# EAGLE design tick-wifi-mini-mk-1.2 (EAGLE 7.5.0)
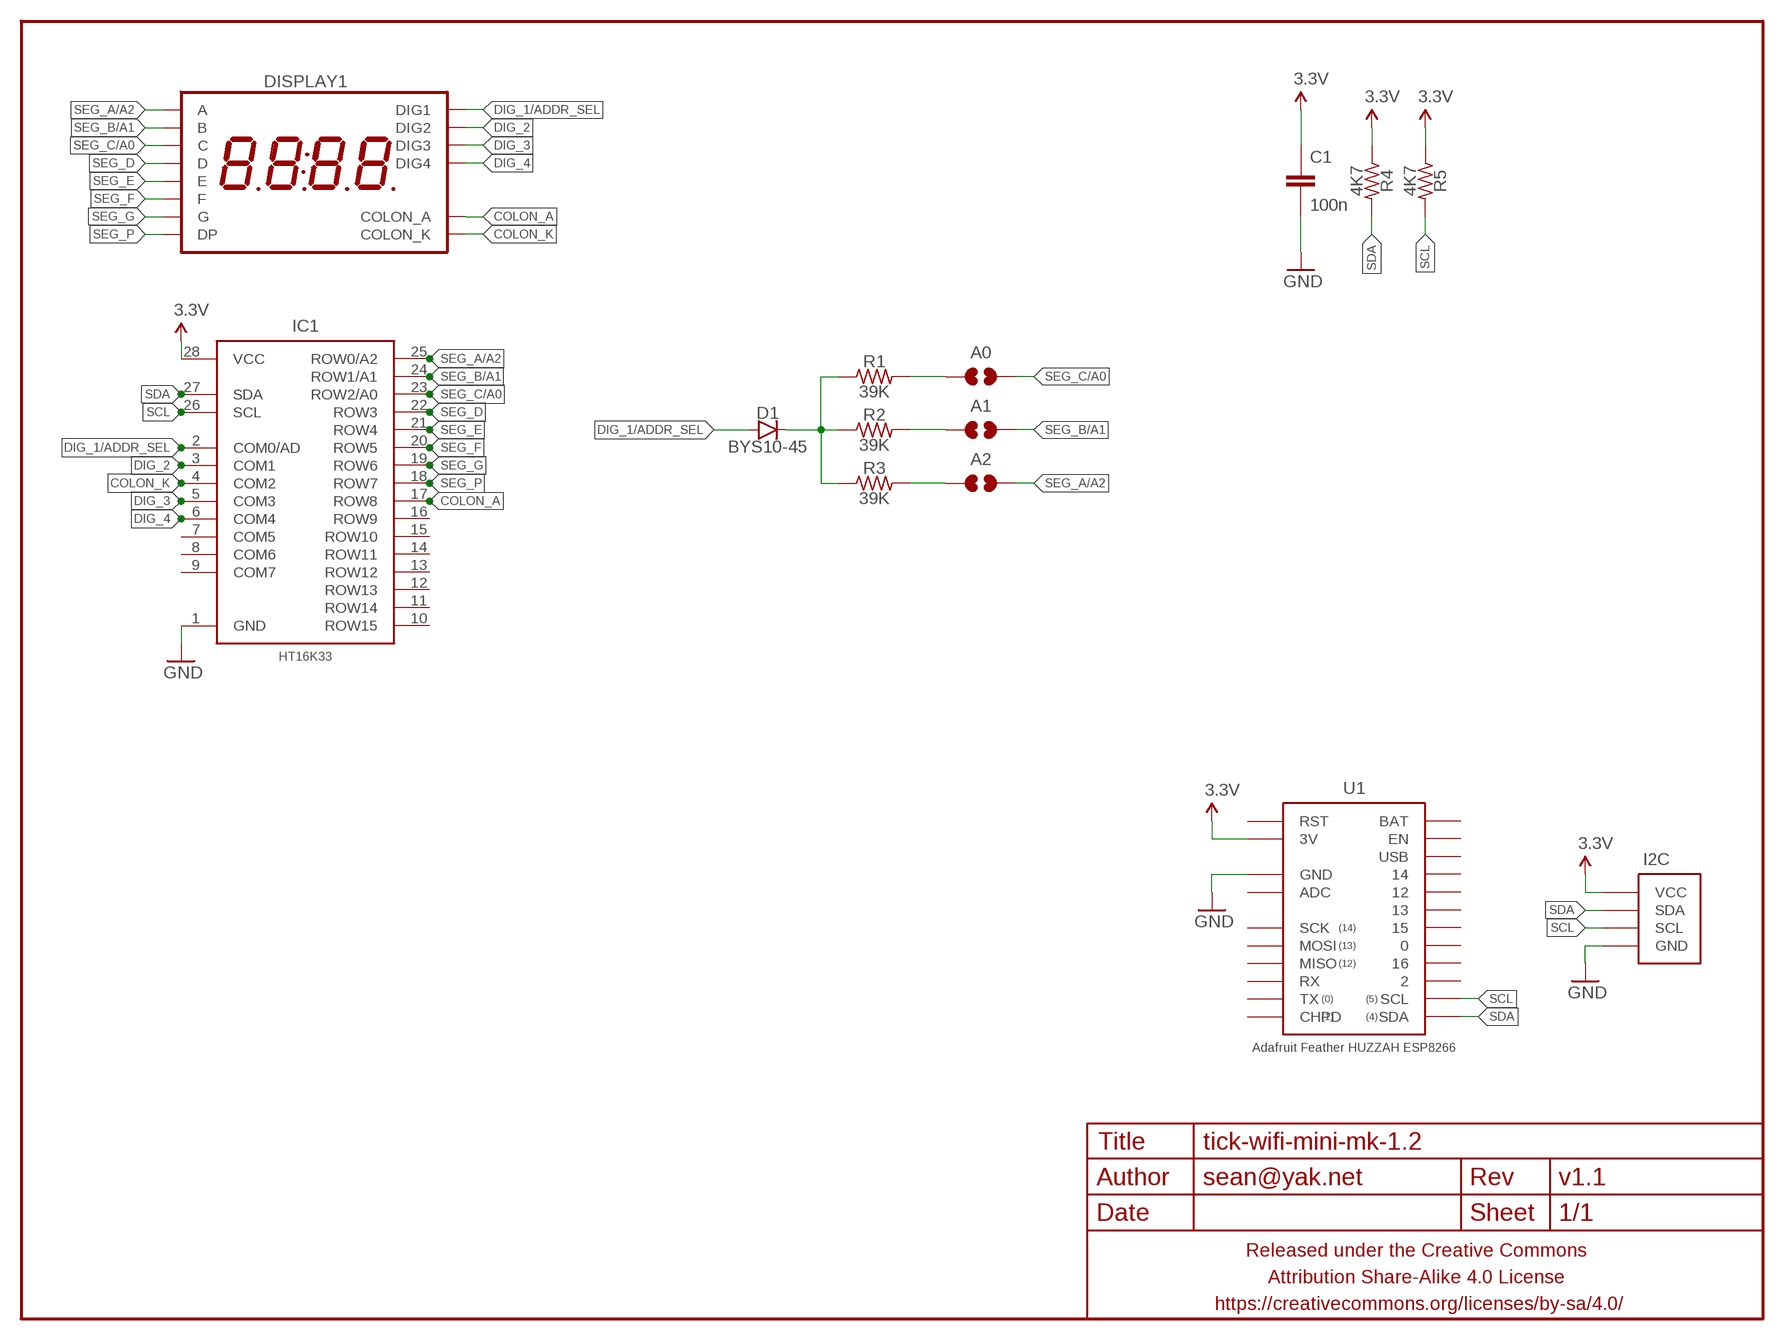
[diagram p0: schematic, sheet 1]

## Parts
A0  JUMPER-PAD-2-NOYES_SILK  [PAD-JUMPER-2-NO_YES_SILK]
A1  JUMPER-PAD-2-NOYES_SILK  [PAD-JUMPER-2-NO_YES_SILK]
A2  JUMPER-PAD-2-NOYES_SILK  [PAD-JUMPER-2-NO_YES_SILK]
C1  100n  CAPACITOR-CERAMICC0805  [C0805]
D1  BYS10-45  DIODESOD123  [SOD123]
DISPLAY1  7SEG_4DIGIT_COLON14.2MM-CC  [7SEG_4DIG_0.56IN_14MM_ADAFRUIT]
FRAME1  FRAME-LETTERNO_PACKAGE  [DUMMY]
I2C  M04-I2CJST-4-PH-VERT-CENTERED-I2C  [JST-4-PH-VERT-PTH-CENTERED-I2C]
IC1  HT16K33  HT16K33-28SOIC28W  [SOIC28W]
R1  39K  RESISTORR0805  [R0805]
R2  39K  RESISTORR0805  [R0805]
R3  39K  RESISTORR0805  [R0805]
R4  4K7  RESISTORR0805  [R0805]
R5  4K7  RESISTORR0805  [R0805]
U1  Adafruit Feather HUZZAH ESP8266  ADAFRUIT_FEATHER_HUZZAH_ESP8266NOSILK  [ADAFRUIT_FEATHER_HUZZAH_NOSILK]

## Nets
3.3V: C1.1 I2C.2(VCC) IC1.28(VCC) R4.1 R5.1 U1.3V
COLON_A: DISPLAY1.P$8(COLON_A) IC1.17(ROW8)
COLON_K: DISPLAY1.P$7(COLON_K) IC1.4(COM2)
DIG_1/ADDR_SEL: D1.A DISPLAY1.P$14(DIG1) IC1.2(COM0/AD)
DIG_2: DISPLAY1.P$11(DIG2) IC1.3(COM1)
DIG_3: DISPLAY1.P$10(DIG3) IC1.5(COM3)
DIG_4: DISPLAY1.P$6(DIG4) IC1.6(COM4)
GND: C1.2 I2C.1(GND) IC1.1(GND) U1.GND@0(GND)
N$1: D1.C R1.1 R2.1 R3.1
N$2: A0.1 R1.2
N$3: A1.1 R2.2
N$4: A2.1 R3.2
SCL: I2C.4(SCL) IC1.26(SCL) R5.2 U1.SCL
SDA: I2C.3(SDA) IC1.27(SDA) R4.2 U1.SDA
SEG_A/A2: A2.2 DISPLAY1.P$13(A) IC1.25(ROW0/A2)
SEG_B/A1: A1.2 DISPLAY1.P$9(B) IC1.24(ROW1/A1)
SEG_C/A0: A0.2 DISPLAY1.P$4(C) IC1.23(ROW2/A0)
SEG_D: DISPLAY1.P$2(D) IC1.22(ROW3)
SEG_E: DISPLAY1.P$1(E) IC1.21(ROW4)
SEG_F: DISPLAY1.P$12(F) IC1.20(ROW5)
SEG_G: DISPLAY1.P$5(G) IC1.19(ROW6)
SEG_P: DISPLAY1.P$3(DP) IC1.18(ROW7)
Unconnected: IC1.7(COM5) IC1.8(COM6) IC1.9(COM7) IC1.10(ROW15) IC1.11(ROW14) IC1.12(ROW13) IC1.13(ROW12) IC1.14(ROW11) IC1.15(ROW10) IC1.16(ROW9) U1.0 U1.2 U1.12 U1.13 U1.14 U1.15 U1.16 U1.ADC U1.BAT U1.CHPD U1.EN U1.MISO U1.MOSI U1.RST U1.RX U1.SCK U1.TX U1.USB

## Library data of the parts
A0 A1 A2 = a_parts:JUMPER-PAD-2-NO
C1 = a_parts:CAPACITOR-CERAMIC: CAPACITOR, European symbol
D1 = a_parts:DIODE: Diode These are standard reverse protection diodes and small signal diodes. SMA package can handle up to about 1A. SOD-323 can handle about 200mA. What the SOD-323 package when ordering, there are some mfgs out there that are 5-pin packages.
DISPLAY1 = a_parts:7SEG_4DIGIT_COLON
FRAME1 = A_butts:FRAME-LETTER: Schematic Frame Standard 8.5x11 US Letter frame; DESIGNER: sean@yak.net; VERSION: v1.1
I2C = a_parts:M04-I2C
IC1 = a_parts:HT16K33-28
R1-R5 = a_parts:RESISTOR: RESISTOR, American symbol
U1 = a_parts:ADAFRUIT_FEATHER_HUZZAH_ESP8266

## Board
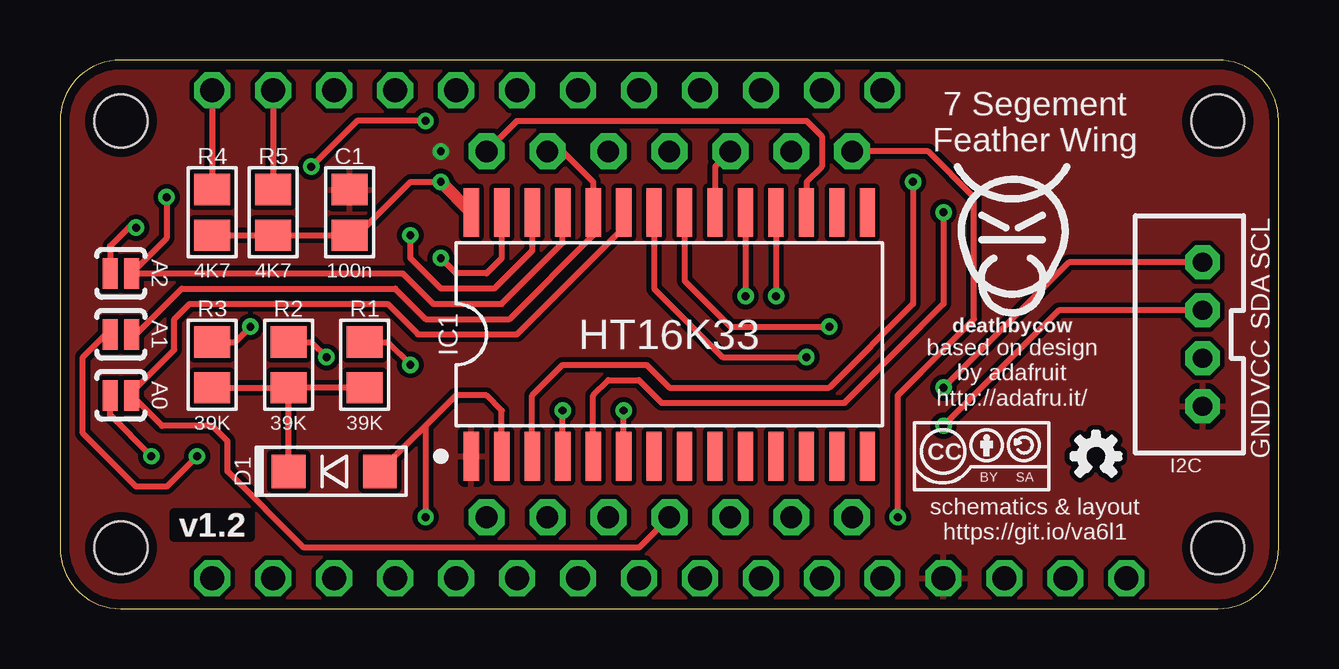
[diagram p1: board, top side]
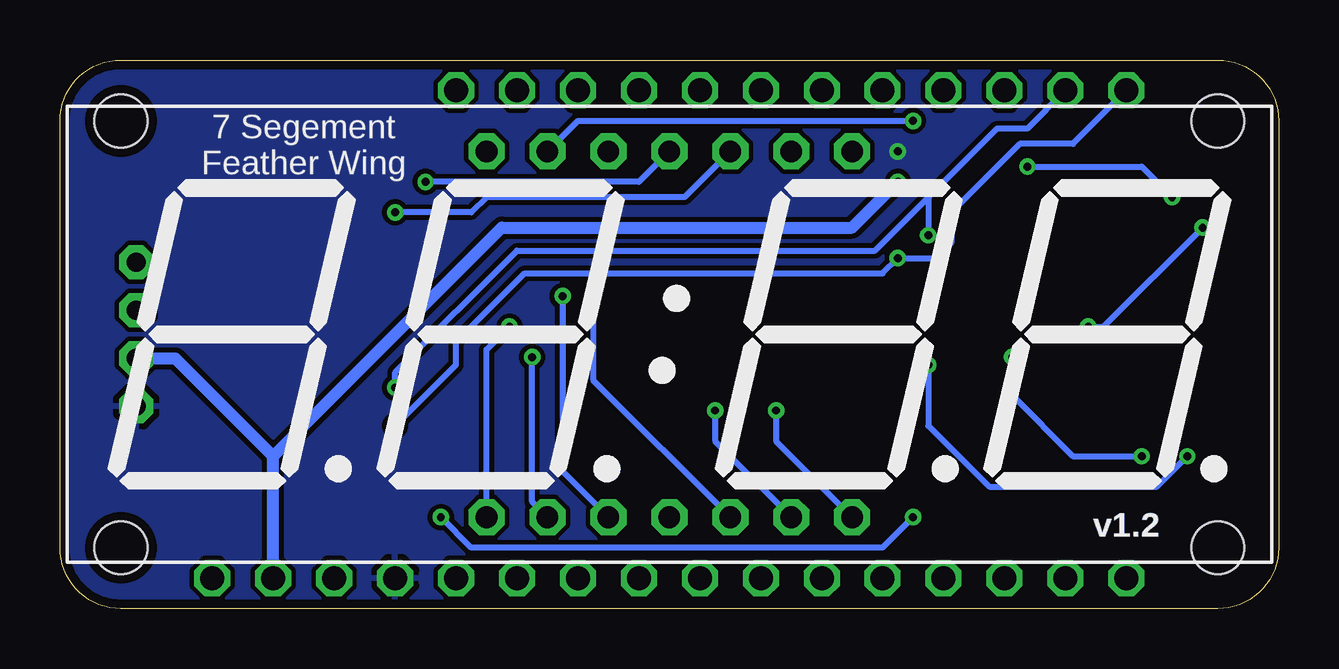
[diagram p2: board, bottom side, seen from below]

Size 50.8 x 22.86 mm. Coordinates in mm from the lower left corner, seen from the top.
Outline: 2.54,0 48.26,0 arc90 50.8,2.54 50.8,20.32 arc90 48.26,22.86 2.54,22.86 arc90 0,20.32 0,2.54 arc90 2.54,0
Copper layers (1*16): Top 0.0356mm / dielectric 1.5011mm / Bottom 0.0356mm
Design rules "LaenPCBOrder_2": minimum track width 6mil, minimum drill 13mil, track to track 6mil, track to pad 6mil, pad to pad 6mil, via to via 6mil, smd to smd 6mil, copper to edge 15mil, drill to drill 6mil, minimum pad ring 7mil, minimum via ring 7mil, stop-mask expansion 3mil, vias tented up to drill 20mil, thermal gap 10mil
Holes 2.2 mm at 2.54,20.32 2.54,2.54 48.26,20.32 48.26,2.54

### Footprints (pad centres in the part's own frame; a part is rotated, then mirrored left to right if it is on the bottom)
PAD-JUMPER-2-NO_YES_SILK = smd 0.635 x 1.27: 1 -0.45,0; 2 0.45,0
C0805 = smd 1.3 x 1.5: 1 -0.95,0; 2 0.95,0
SOD123 = smd 1.4 x 1.4: A 1.9,0; C -1.9,0
7SEG_4DIG_0.56IN_14MM_ADAFRUIT = drill 0.9 pad 1.5 octagon: P$1 -7.62,-7.62; P$2 -5.08,-7.62; P$3 -2.54,-7.62; P$4 0,-7.62; P$5 2.54,-7.62; P$6 5.08,-7.62; P$7 7.62,-7.62; P$8 7.62,7.62; P$9 5.08,7.62; P$10 2.54,7.62; P$11 0,7.62; P$12 -2.54,7.62; P$13 -5.08,7.62; P$14 -7.62,7.62
JST-4-PH-VERT-PTH-CENTERED-I2C = drill 0.8 pad 1.422 octagon: 1 -3,0; 2 -1,0; 3 1,0; 4 3,0
SOIC28W = smd 0.635 x 2.032: 1 -8.255,-5.08; 2 -6.985,-5.08; 3 -5.715,-5.08; 4 -4.445,-5.08; 5 -3.175,-5.08; 6 -1.905,-5.08; 7 -0.635,-5.08; 8 0.635,-5.08; 9 1.905,-5.08; 10 3.175,-5.08; 11 4.445,-5.08; 12 5.715,-5.08; 13 6.985,-5.08; 14 8.255,-5.08; 15 8.255,5.08; 16 6.985,5.08; 17 5.715,5.08; 18 4.445,5.08; 19 3.175,5.08; 20 1.905,5.08; 21 0.635,5.08; 22 -0.635,5.08; 23 -1.905,5.08; 24 -3.175,5.08; 25 -4.445,5.08; 26 -5.715,5.08; 27 -6.985,5.08; 28 -8.255,5.08
R0805 = smd 1.3 x 1.5: 1 -0.95,0; 2 0.95,0
ADAFRUIT_FEATHER_HUZZAH_NOSILK = drill 1 pad 1.5 octagon: 0 8.89,10.16; 2 13.97,10.16; 3V -16.51,-10.16; 12 1.27,10.16; 13 3.81,10.16; 14 -1.27,10.16; 15 6.35,10.16; 16 11.43,10.16; ADC -8.89,-10.16; BAT -8.89,10.16; CHPD 19.05,-10.16; EN -6.35,10.16; GND@0 -11.43,-10.16; MISO 11.43,-10.16; MOSI 8.89,-10.16; NC@3 -13.97,-10.16; NC@6 -6.35,-10.16; NC@7 -3.81,-10.16; NC@8 -1.27,-10.16; NC@9 1.27,-10.16; NC@10 3.81,-10.16; RST -19.05,-10.16; RX 13.97,-10.16; SCK 6.35,-10.16; SCL 16.51,10.16; SDA 19.05,10.16; TX 16.51,-10.16; USB -3.81,10.16

### Placement (x,y rotation side)
A0  2.54,8.89 0 top
A1  2.54,11.43 0 top
A2  2.54,13.97 0 top
C1  12.06,16.51 90 top
D1  11.43,5.71 0 top
DISPLAY1  25.4,11.43 0 bottom
FRAME1  0,0 0 top
I2C  47.62,11.43 90 top
IC1  25.4,11.43 0 top
R1  12.7,10.16 90 top
R2  9.53,10.16 90 top
R3  6.35,10.16 90 top
R4  6.35,16.51 90 top
R5  8.89,16.51 90 top
U1  25.4,11.43 0 bottom
U$1  [OSHWLOGO_TINY]  43.18,6.35 0 top
U$2  [COW_SMALL]  39.69,15.88 0 top
U$4  [CC-BY-SA-4.0-NO-URL]  38.42,6.35 0 top

### Tracks (layer width: path | path; a pad name or v marks a point on that pad's centre or on a via)
3.3V  (via drill 0.33)
  Top 0.254: R4.1 R5.1 C1.1 12.38,15.56 14.61,17.78 v15.88,17.78
  Top 0.508: IC1.28 v15.88,17.78
  Bottom 0.508: U1.3V 41.91,6.35 | 41.91,6.35 32.38,15.88 17.78,15.88 v15.88,17.78 | I2C.2 45.99,10.43 41.91,6.35
COLON_A
  Top 0.254: DISPLAY1.P$8 19.05,20.32 31.11,20.32 31.75,19.68 31.75,18.41 31.11,17.78 IC1.17
COLON_K  (via drill 0.33)
  Top 0.254: IC1.4 v20.95,8.26
  Bottom 0.254: v20.95,8.26 20.95,6.99 DISPLAY1.P$7
DIG_1/ADDR_SEL  (via drill 0.33)
  Top 0.254: IC1.2 18.41,8.26 17.78,8.89 16.51,8.89 | 16.51,8.89 16.5,8.89 D1.A | 16.51,8.89 15.24,7.62 v15.24,3.81 | v34.92,3.81 34.92,8.89 38.1,12.06 38.1,17.14 36.2,19.05 DISPLAY1.P$14
  Bottom 0.254: v15.24,3.81 16.51,2.54 33.66,2.54 v34.92,3.81
DIG_2  (via drill 0.33)
  Top 0.254: IC1.3 19.68,8.89 20.95,10.16 24.45,10.16 25.4,9.21 32.07,9.21 35.56,12.7 v35.56,17.78
  Bottom 0.254: DISPLAY1.P$11 26.67,17.78 v35.56,17.78
DIG_3  (via drill 0.33)
  Top 0.254: IC1.5 22.23,8.89 22.86,9.53 24.13,9.53 25.08,8.57 32.7,8.57 36.83,12.7 v36.83,16.51
  Bottom 0.254: DISPLAY1.P$10 24.77,17.14 33.02,17.14 33.66,16.51 v36.83,16.51
DIG_4  (via drill 0.33)
  Top 0.254: IC1.6 v23.5,8.26
  Bottom 0.254: v23.5,8.26 23.5,6.99 DISPLAY1.P$6
GND  (via drill 0.33)
  other vias: 15.88,19.05
  pour Top (isolate 0.2): 2.54,22.86 48.26,22.86 arc-90 50.8,20.32 50.8,2.54 arc-90 48.26,0 2.54,0 arc-90 0,2.54 0,20.32 arc-90
  pour Bottom (isolate 0.2): 2.54,22.86 48.26,22.86 arc-90 50.8,20.32 50.8,2.54 arc-90 48.26,0 2.54,0 arc-90 0,2.54 0,20.32 arc-90
N$1
  Top 0.254: D1.C R2.1 | R3.1 R2.1 | R1.1 R2.1
N$2  (via drill 0.33)
  Top 0.254: R1.2 13.65,11.11 v14.61,10.16 | v3.81,6.35 2.09,8.07 A0.1
  Bottom 0.254: v14.61,10.16 14.61,7.62 12.06,5.08 5.08,5.08 v3.81,6.35
N$3  (via drill 0.33)
  Top 0.254: R2.2 10.47,11.11 v11.11,10.48 | v5.71,6.35 4.45,5.08 3.17,5.08 0.95,7.3 0.95,10.48 1.91,11.43 A1.1
  Bottom 0.254: v11.11,10.48 11.11,8.89 8.57,6.35 v5.71,6.35
N$4  (via drill 0.33)
  Top 0.254: R3.2 7.3,11.11 v7.94,11.75 | v3.17,15.88 2.86,15.88 2.09,15.11 A2.1
  Bottom 0.254: v7.94,11.75 7.3,11.75 v3.17,15.88
SCL  (via drill 0.33)
  Top 0.254: U1.SCL R5.2 | IC1.26 19.68,14.92 18.1,13.34 15.88,13.34 14.61,14.61 v14.61,15.56 | I2C.4 42.05,14.43 v36.83,9.21
  Bottom 0.254: U1.SCL 10.48,20 11.75,20 14.61,17.14 | v36.83,9.21 36.83,9.84 31.75,14.92 16.83,14.92 14.61,17.14 | 14.61,17.14 v14.61,15.56
SDA  (via drill 0.33)
  Top 0.254: U1.SDA R4.2 | IC1.27 18.41,14.61 17.78,13.97 16.51,13.97 v15.88,14.61 | I2C.3 41.64,12.43 v36.83,7.62
  Bottom 0.254: U1.SDA 8.57,19.37 10.79,19.37 13.65,16.51 13.65,15.24 14.29,14.61 v15.88,14.61 16.51,13.97 31.43,13.97 34.29,11.11 34.29,10.16 v36.83,7.62
SEG_A/A2  (via drill 0.33)
  Top 0.254: IC1.25 20.95,15.24 18.41,12.7 15.56,12.7 14.29,13.97 A2.2 4.45,15.43 v4.45,17.14 | v15.24,20.32 12.38,20.32 v10.48,18.41
  Bottom 0.254: DISPLAY1.P$13 29.21,20.32 v15.24,20.32 | v10.48,18.41 5.71,18.41 v4.45,17.14
SEG_B/A1
  Top 0.254: DISPLAY1.P$9 20.95,19.05 22.23,17.78 IC1.24 22.23,15.56 18.73,12.06 15.24,12.06 13.97,13.34 5.08,13.34 3.17,11.43 A1.2
SEG_C/A0
  Top 0.254: IC1.23 23.5,15.88 19.05,11.43 14.92,11.43 13.65,12.7 5.4,12.7 4.76,12.06 4.76,10.79 2.99,9.02 A0.2 4.26,7.62 6.35,7.62 6.99,6.99 6.99,5.71 10.16,2.54 24.13,2.54 DISPLAY1.P$4
SEG_D  (via drill 0.33)
  Top 0.254: IC1.22 24.77,13.34 27.62,10.48 v31.11,10.48
  Bottom 0.254: DISPLAY1.P$2 31.11,4.45 v31.11,10.48
SEG_E  (via drill 0.33)
  Top 0.254: IC1.21 26.04,13.65 27.94,11.75 v32.07,11.75
  Bottom 0.254: DISPLAY1.P$1 33.02,10.79 v32.07,11.75
SEG_F
  Top 0.254: DISPLAY1.P$12 27.3,18.41 IC1.20
SEG_G  (via drill 0.33)
  Top 0.254: IC1.19 v28.57,13.02
  Bottom 0.254: v28.57,13.02 28.57,9.53 DISPLAY1.P$5
SEG_P  (via drill 0.33)
  Top 0.254: IC1.18 v29.84,13.02
  Bottom 0.254: v29.84,13.02 29.84,5.71 DISPLAY1.P$3

### Text on the board
tPlace: 7 Segement / Feather Wing | based on design / by adafruit / http://adafru.it/ | schematics & layout / https://git.io/va6l1
bPlace: 7 Segement / Feather Wing